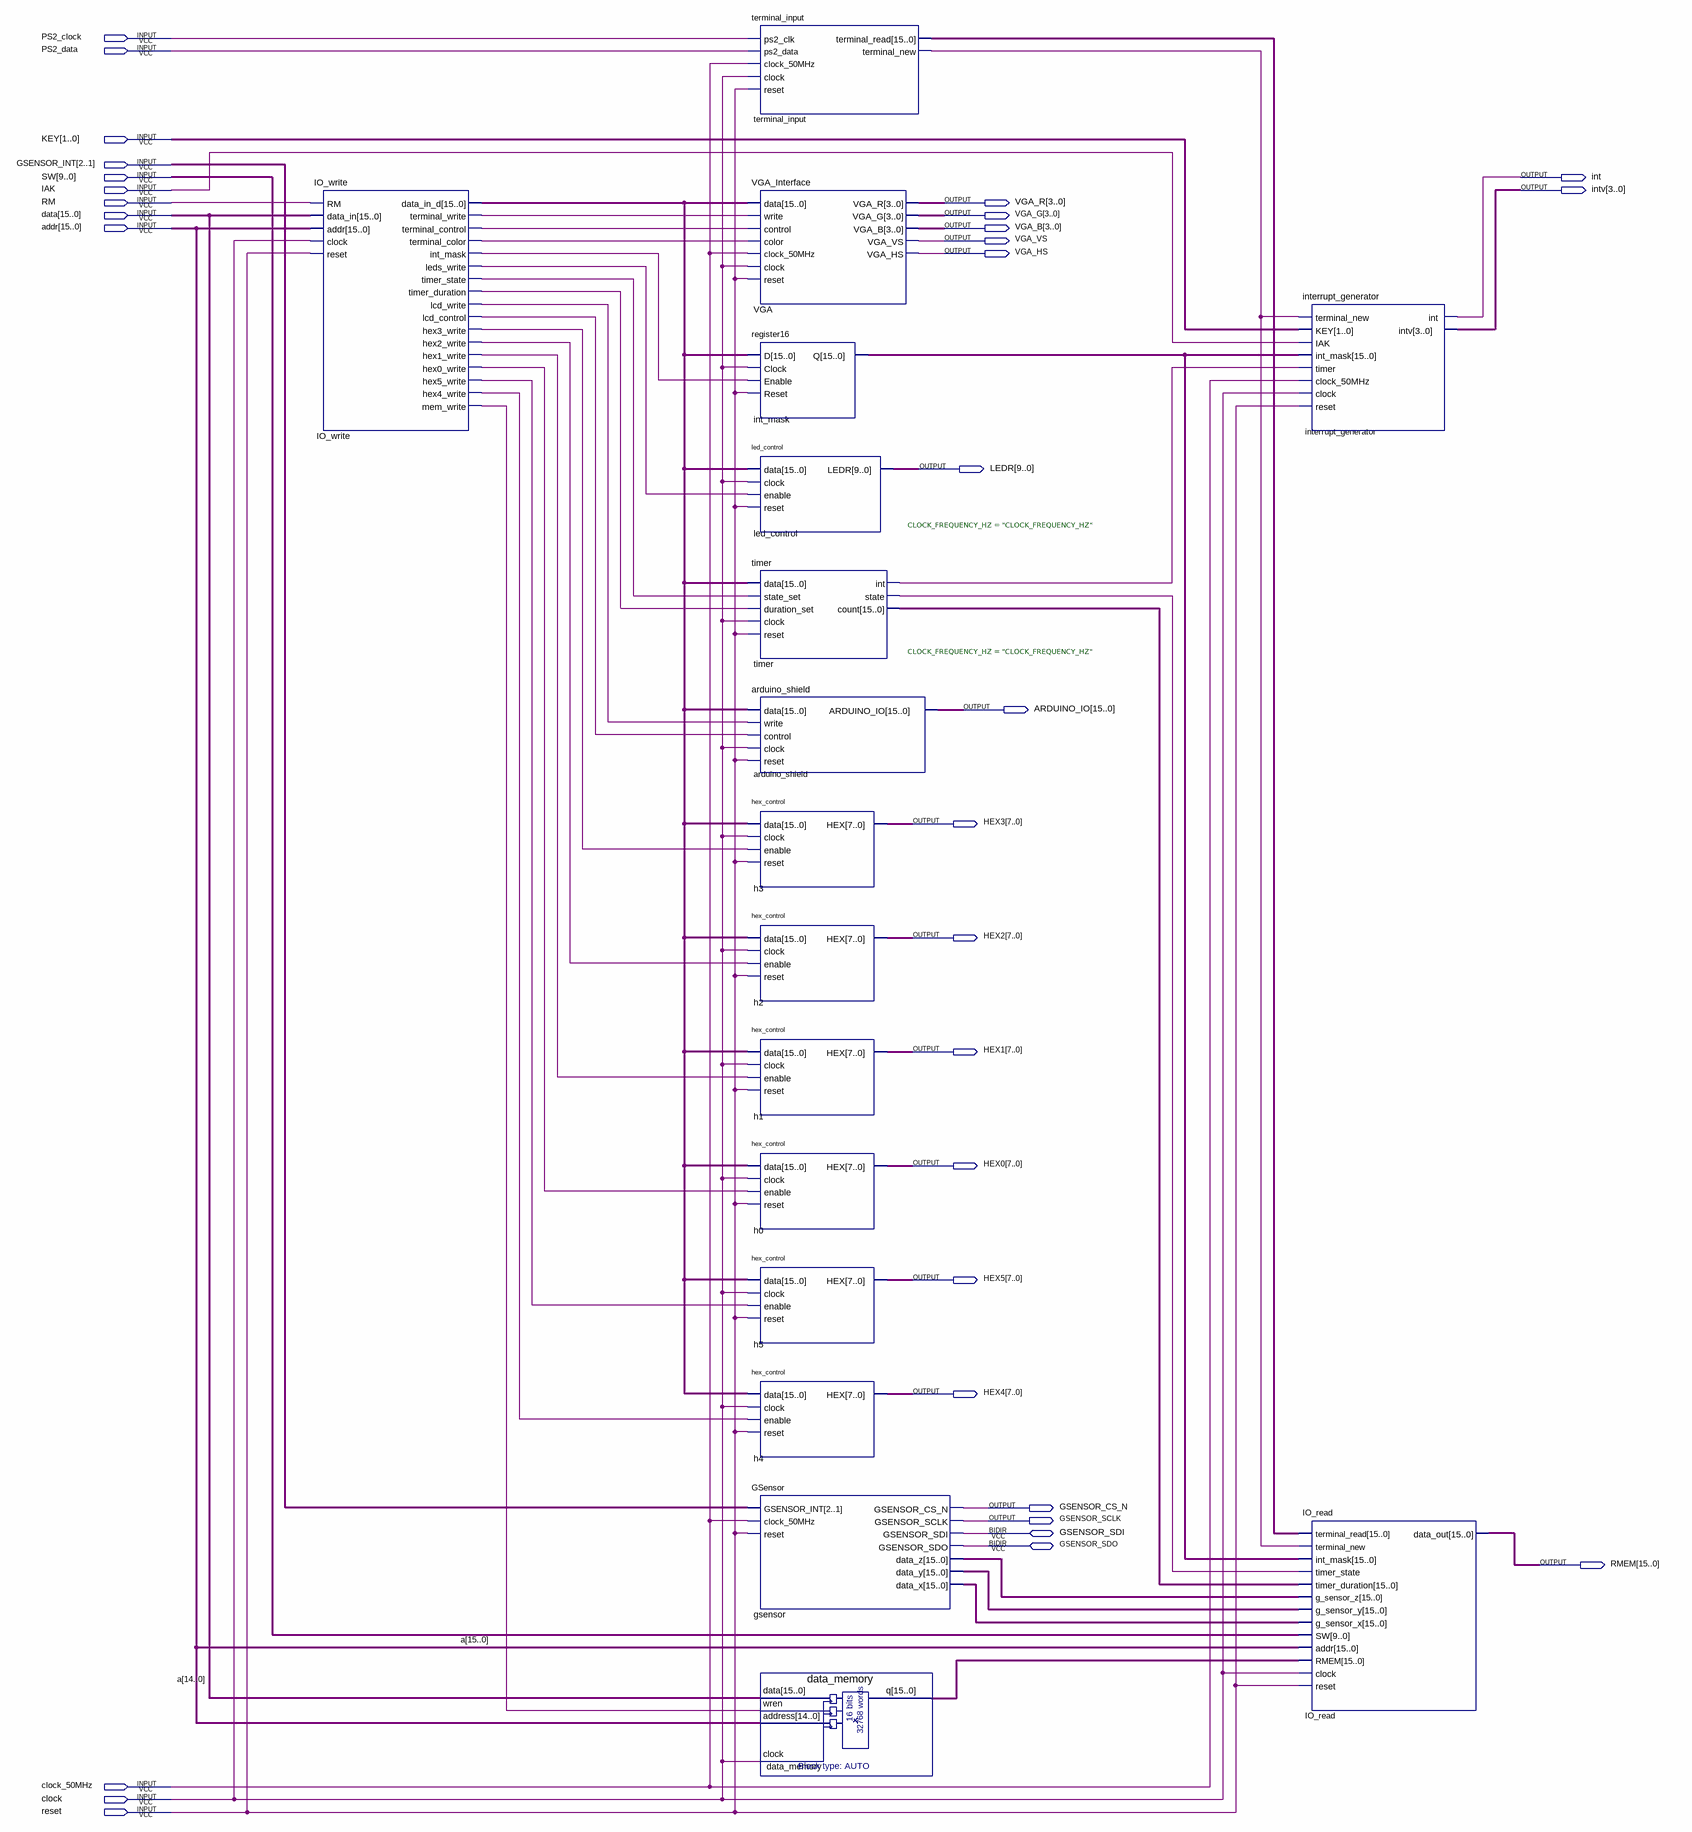
[diagram p0: schematic sheet]
// Quartus schematic hardware.bdf as structural Verilog: 17 symbols, 32 pins
module hardware (
  input  PS2_clock,
  input  PS2_data,
  input  [1:0] KEY,
  input  [2:1] GSENSOR_INT,
  input  [9:0] SW,
  input  IAK,
  input  RM,
  input  [15:0] data,
  input  [15:0] addr,
  input  clock_50MHz,
  input  clock,
  input  reset,
  inout  GSENSOR_SDI,
  inout  GSENSOR_SDO,
  output \int ,
  output [3:0] intv,
  output [3:0] VGA_R,
  output [3:0] VGA_G,
  output [3:0] VGA_B,
  output VGA_VS,
  output VGA_HS,
  output [9:0] LEDR,
  output [15:0] ARDUINO_IO,
  output [7:0] HEX3,
  output [7:0] HEX2,
  output [7:0] HEX1,
  output [7:0] HEX0,
  output [7:0] HEX5,
  output [7:0] HEX4,
  output GSENSOR_CS_N,
  output GSENSOR_SCLK,
  output [15:0] RMEM
);

  wire IO_write_hex0_write, IO_write_hex1_write, IO_write_hex2_write, IO_write_hex3_write,
       IO_write_hex4_write, IO_write_hex5_write, IO_write_int_mask, IO_write_lcd_control, IO_write_lcd_write,
       IO_write_leds_write, IO_write_mem_write, IO_write_terminal_color, IO_write_terminal_control,
       IO_write_terminal_write, IO_write_timer_duration, IO_write_timer_state, terminal_input_terminal_new,
       timer_int, timer_state;
  wire [15:0] data_memory_q, gsensor_data_x, gsensor_data_y, gsensor_data_z, int_mask_q, IO_write_data_in_d,
       terminal_input_terminal_read, timer_count;

  IO_write IO_write (
    .RM(RM), .data_in(data), .addr(addr), .clock(clock), .reset(reset), .data_in_d(IO_write_data_in_d),
    .terminal_write(IO_write_terminal_write), .terminal_control(IO_write_terminal_control),
    .terminal_color(IO_write_terminal_color), .int_mask(IO_write_int_mask), .leds_write(IO_write_leds_write),
    .timer_state(IO_write_timer_state), .timer_duration(IO_write_timer_duration),
    .lcd_write(IO_write_lcd_write), .lcd_control(IO_write_lcd_control), .hex3_write(IO_write_hex3_write),
    .hex2_write(IO_write_hex2_write), .hex1_write(IO_write_hex1_write), .hex0_write(IO_write_hex0_write),
    .hex5_write(IO_write_hex5_write), .hex4_write(IO_write_hex4_write), .mem_write(IO_write_mem_write));
  terminal_input terminal_input (
    .ps2_clk(PS2_clock), .ps2_data(PS2_data), .clock_50MHz(clock_50MHz), .clock(clock), .reset(reset),
    .terminal_read(terminal_input_terminal_read), .terminal_new(terminal_input_terminal_new));
  VGA_Interface VGA (
    .data(IO_write_data_in_d), .write(IO_write_terminal_write), .control(IO_write_terminal_control),
    .color(IO_write_terminal_color), .clock_50MHz(clock_50MHz), .clock(clock), .reset(reset), .VGA_R(VGA_R),
    .VGA_G(VGA_G), .VGA_B(VGA_B), .VGA_VS(VGA_VS), .VGA_HS(VGA_HS));
  register16 int_mask (
    .D(IO_write_data_in_d), .Clock(clock), .Enable(IO_write_int_mask), .Reset(reset), .Q(int_mask_q));
  led_control led_control (
    .data(IO_write_data_in_d), .clock(clock), .enable(IO_write_leds_write), .reset(reset), .LEDR(LEDR));
  timer #(.CLOCK_FREQUENCY_HZ("CLOCK_FREQUENCY_HZ")) timer (
    .data(IO_write_data_in_d), .state_set(IO_write_timer_state), .duration_set(IO_write_timer_duration),
    .clock(clock), .reset(reset), .\int (timer_int), .state(timer_state), .count(timer_count));
  arduino_shield #(.CLOCK_FREQUENCY_HZ("CLOCK_FREQUENCY_HZ")) arduino_shield (
    .data(IO_write_data_in_d), .write(IO_write_lcd_write), .control(IO_write_lcd_control), .clock(clock),
    .reset(reset), .ARDUINO_IO(ARDUINO_IO));
  hex_control h3 (.data(IO_write_data_in_d), .clock(clock), .enable(IO_write_hex3_write), .reset(reset), .HEX(HEX3));
  hex_control h2 (.data(IO_write_data_in_d), .clock(clock), .enable(IO_write_hex2_write), .reset(reset), .HEX(HEX2));
  hex_control h1 (.data(IO_write_data_in_d), .clock(clock), .enable(IO_write_hex1_write), .reset(reset), .HEX(HEX1));
  hex_control h0 (.data(IO_write_data_in_d), .clock(clock), .enable(IO_write_hex0_write), .reset(reset), .HEX(HEX0));
  hex_control h5 (.data(IO_write_data_in_d), .clock(clock), .enable(IO_write_hex5_write), .reset(reset), .HEX(HEX5));
  hex_control h4 (.data(IO_write_data_in_d), .clock(clock), .enable(IO_write_hex4_write), .reset(reset), .HEX(HEX4));
  GSensor gsensor (
    .GSENSOR_INT(GSENSOR_INT), .clock_50MHz(clock_50MHz), .reset(reset), .GSENSOR_CS_N(GSENSOR_CS_N),
    .GSENSOR_SCLK(GSENSOR_SCLK), .data_z(gsensor_data_z), .data_y(gsensor_data_y), .data_x(gsensor_data_x),
    .GSENSOR_SDI(GSENSOR_SDI), .GSENSOR_SDO(GSENSOR_SDO));
  data_memory data_memory (
    .data(data), .wren(IO_write_mem_write), .address(addr[14:0]), .clock(clock), .q(data_memory_q));
  interrupt_generator interrupt_generator (
    .terminal_new(terminal_input_terminal_new), .KEY(KEY), .IAK(IAK), .int_mask(int_mask_q),
    .timer(timer_int), .clock_50MHz(clock_50MHz), .clock(clock), .reset(reset), .\int (\int ), .intv(intv));
  IO_read IO_read (
    .terminal_read(terminal_input_terminal_read), .terminal_new(terminal_input_terminal_new),
    .int_mask(int_mask_q), .timer_state(timer_state), .timer_duration(timer_count),
    .g_sensor_z(gsensor_data_z), .g_sensor_y(gsensor_data_y), .g_sensor_x(gsensor_data_x), .SW(SW),
    .addr(addr), .RMEM(data_memory_q), .clock(clock), .reset(reset), .data_out(RMEM));

  // Other names for the same wires on the sheet: a[15:0] = addr
endmodule
